# EAGLE design afe (EAGLE 6.6.0)

## Sheet 1 of 2
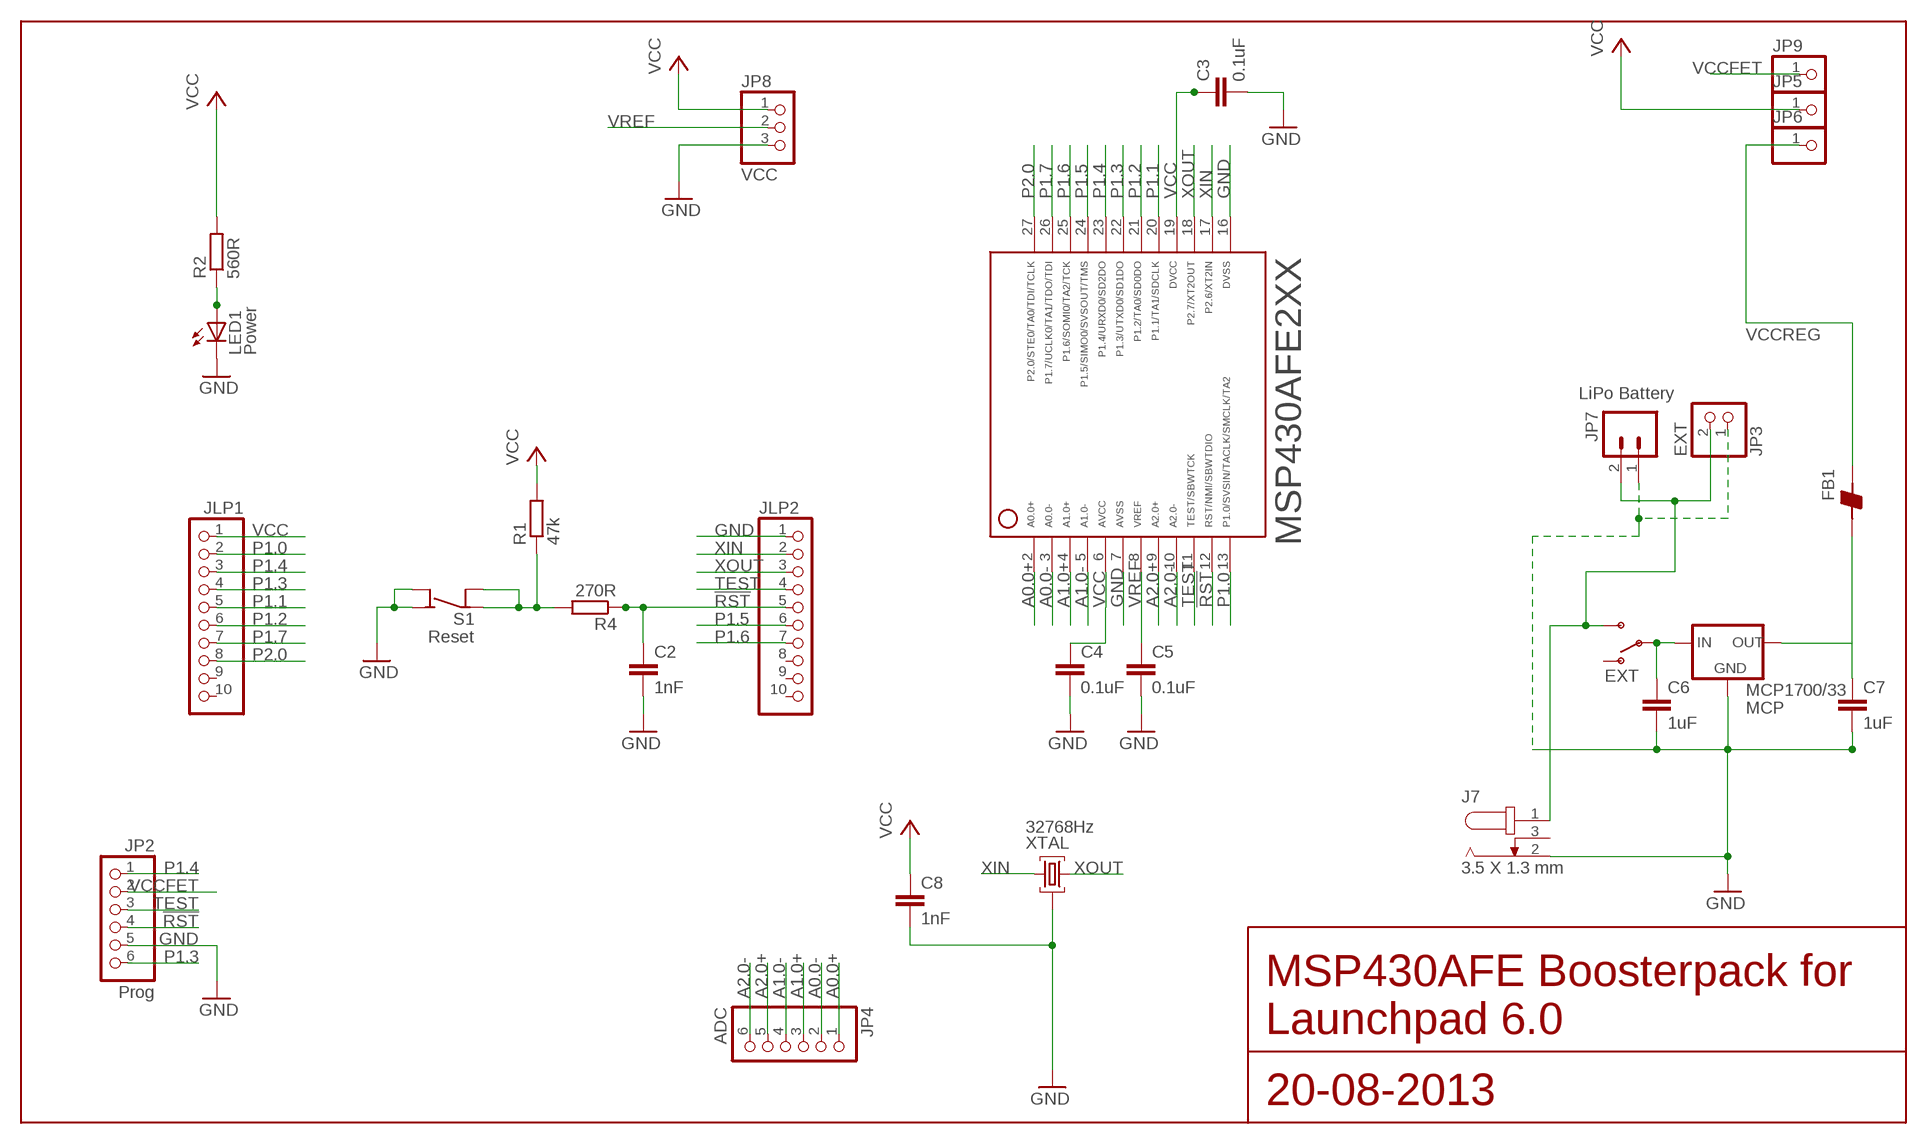
[diagram p0: schematic, sheet 1]

### Parts
C2  1nF  C-EUC0805  [C0805]
C3  0.1uF  C-EUC0805  [C0805]
C4  0.1uF  C-EUC0805  [C0805]
C5  0.1uF  C-EUC0805  [C0805]
C6  1uF  C-EUC0805  [C0805]
C7  1uF  C-EUC0805  [C0805]
C8  1nF  C-EUC0805  [C0805]
FB1  BEAD-0805  [0805]
J7  3.5 X 1.3 mm  DC_JACK_3.5X1.3MM  [3.5X1.3MM_DC_JACK]
JLP1  PH1X10OCT076  [PH1X10OCT76]
JLP2  PH1X10OCT076  [PH1X10OCT76]
JP2  Prog  PINHD-1X6  [1X06]
JP3  EXT  PINHD-1X2  [1X02]
JP4  ADC  PINHD-1X6  [1X06]
JP5  PINHD-1X1  [1X01]
JP6  PINHD-1X1  [1X01]
JP7  LiPo Battery  M02JST-PTH-2  [JST-2-PTH]
JP8  VCC  PINHD-1X3  [1X03]
JP9  PINHD-1X1  [1X01]
LED1  Power  LEDCHIPLED_1206  [CHIPLED_1206]
MCP1700/33  MCP  MCP1700SOT-23  [SOT-23]
MSP430AFE  AFE2XX--PW24  [PW24]
ON  EXT  SWITCH-SPSTPTH  [SWITCH-SPDT]
R1  47k  R-EU_R0805  [R0805]
R2  560R  R-EU_R0805  [R0805]
R4  270R  R-EU_R0805  [R0805]
S1  Reset  SPST4  [6MMTACTILE_4PIN]
XTAL  32768Hz  QUARZ5  [QUARZ5]

### Nets
!RST: C2.1 JLP2.5 JP2.4 MSP430AFE.12 R4.1
A0.0+ [AD]: JP4.1 MSP430AFE.2
A0.0- [AD]: JP4.2 MSP430AFE.3
A1.0+ [AD]: JP4.3 MSP430AFE.4
A1.0- [AD]: JP4.4 MSP430AFE.5
A2.0+ [AD]: JP4.5 MSP430AFE.9
A2.0- [AD]: JP4.6 MSP430AFE.10
GND [GND]: C2.2 C3.2 C4.2 C5.2 C6.2 C7.2 C8.2 J7.2 JLP2.1 JP2.5 JP3.1 JP7.1 JP8.3 LED1.C MCP1700/33.1(GND) MSP430AFE.7 MSP430AFE.16 S1.A1(NO) S1.A2(NO) XTAL.GND@0
N$4: LED1.A R2.1
N$5: R1.1 R4.2 S1.B1(COM) S1.B2(COM)
P1.0: JLP1.2 MSP430AFE.13
P1.1: JLP1.5 MSP430AFE.20
P1.2: JLP1.6 MSP430AFE.21
P1.3: JLP1.4 JP2.6 MSP430AFE.22
P1.4: JLP1.3 JP2.1 MSP430AFE.23
P1.5: JLP2.6 MSP430AFE.24
P1.6: JLP2.7 MSP430AFE.25
P1.7: JLP1.7 MSP430AFE.26
P2.0: JLP1.8 MSP430AFE.27
TEST: JLP2.4 JP2.3 MSP430AFE.11
VCC [VCC]: C3.1 C4.1 C8.1 JLP1.1 JP5.1 JP8.1 MSP430AFE.6 MSP430AFE.19 R1.2 R2.2
VCCEXT [VCCEXT]: J7.1 JP3.2 JP7.2 ON.3(S)
VCCFET [VCC]: JP2.2 JP9.1
VCCIN [VCCEXT]: C6.1 MCP1700/33.3(IN) ON.2(P)
VCCREG [VCCEXT]: FB1.2 JP6.1
VCCREGOUT [VCCEXT]: C7.1 FB1.1 MCP1700/33.2(OUT)
VREF: C5.1 JP8.2 MSP430AFE.8
XIN: JLP2.2 MSP430AFE.17 XTAL.2
XOUT: JLP2.3 MSP430AFE.18 XTAL.1
Unconnected: J7.3 JLP1.9 JLP1.10 JLP2.8 JLP2.9 JLP2.10 ON.1(O)

### Notes on the sheet
- MSP430AFE Boosterpack for
  Launchpad 6.0
- 20-08-2013

## Sheet 2 of 2

## Library data of the parts
C2-C8 = resistor:C-EU: CAPACITOR, European symbol
FB1 = CH_passive:BEAD
J7 = MY_CONN:DC_JACK_3.5X1.3MM
JLP1 JLP2 = MY_CONN:PH1X10
JP2 JP4 = pinhead:PINHD-1X6: PIN HEADER
JP3 = pinhead:PINHD-1X2: PIN HEADER
JP5 JP6 JP9 = pinhead:PINHD-1X1: PIN HEADER
JP7 = SparkFun:M02: Header 2 Standard 2-pin 0.1" header. Use with straight break away headers (SKU : PRT-00116), right angle break away headers (PRT-00553), swiss pins (PRT-00743), machine pins (PRT-00117), and female headers (PRT-00115). Molex polarized connector foot print use with SKU : PRT-08233 with associated crimp pins and housings.
JP8 = pinhead:PINHD-1X3: PIN HEADER
LED1 = adafruit:LED: LED OSRAM: - CHIPLED LG R971, LG N971, LY N971, LG Q971, LY Q971, LO R971, LY R971 LH N974, LH R974 LS Q976, LO Q976, LY Q976 LO Q996 - Hyper CHIPLED LW Q18S LB Q993, LB Q99A, LB R99A - SideLED LS A670, LO A670, LY A670, LG A670, LP A670 LB A673, LV A673, LT A673, LW A673 LH A674 LY A675 LS A676, LA A676, LO A676, LY A676, LW A676 LS A679, LY A679, LG A679 - Hyper Micro SIDELED® LS Y876, LA Y876, LO Y876, LY Y876 LT Y87S - SmartLED LW L88C, LW L88S LB L89C, LB L89S, LG L890 LS L89K, LO L89K, LY L89K LS L896, LA L896, LO L896, LY L896 - TOPLED LS T670, LO T670, LY T670, LG T670, LP T670 LSG T670, LSP T670, LSY T670, LOP T670, LYG T670 LG T671, LOG T671, LSG T671 LB T673, LV T673, LT T673, LW T673 LH T674 LS T676, LA T676, LO T676, LY T676, LB T676, LH T676, LSB T676, LW T676 LB T67C, LV T67C, LT T67C, LS T67K, LO T67K, LY T67K, LW E67C LS E67B, LA E67B, LO E67B, LY E67B, LB E67C, LV E67C, LT E67C LW T67C LS T679, LY T679, LG T679 LS T770, LO T770, LY T770, LG T770, LP T770 LB T773, LV T773, LT T773, LW T773 LH T774 LS E675, LA E675, LY E675, LS T675 LS T776, LA T776, LO T776, LY T776, LB T776 LHGB T686 LT T68C, LB T68C - Hyper Mini TOPLED® LB M676 - Mini TOPLED Santana® LG M470 LS M47K, LO M47K, LY M47K Source: http://www.osram.convergy.de/
MCP1700/33 = MY_IC:MCP1700
MSP430AFE = TI_MSP430_v16:AFE2XX--PW24
ON = SparkFun:SWITCH-SPST: SPST Switch Simple slide switch. Spark Fun Electronics SKU : COM-00102
R1 R2 R4 = resistor:R-EU_: RESISTOR, European symbol
S1 = mes_electromech:SPST4: SPST switch with 2 pins per contact
XTAL = my_xtal:QUARZ5

## Net classes
0 default: width 0.279 mm, drill 0.508 mm, clearance 0.229 mm
1 GND: width 0.61 mm, drill 0.508 mm, clearance 0.229 mm
2 VCC: width 0.61 mm, drill 0.508 mm, clearance 0.229 mm
3 AD: width 0.33 mm, drill 0.508 mm, clearance 0.229 mm
4 VCCEXT: width 0.762 mm, drill 0.508 mm, clearance 0.229 mm

## Board
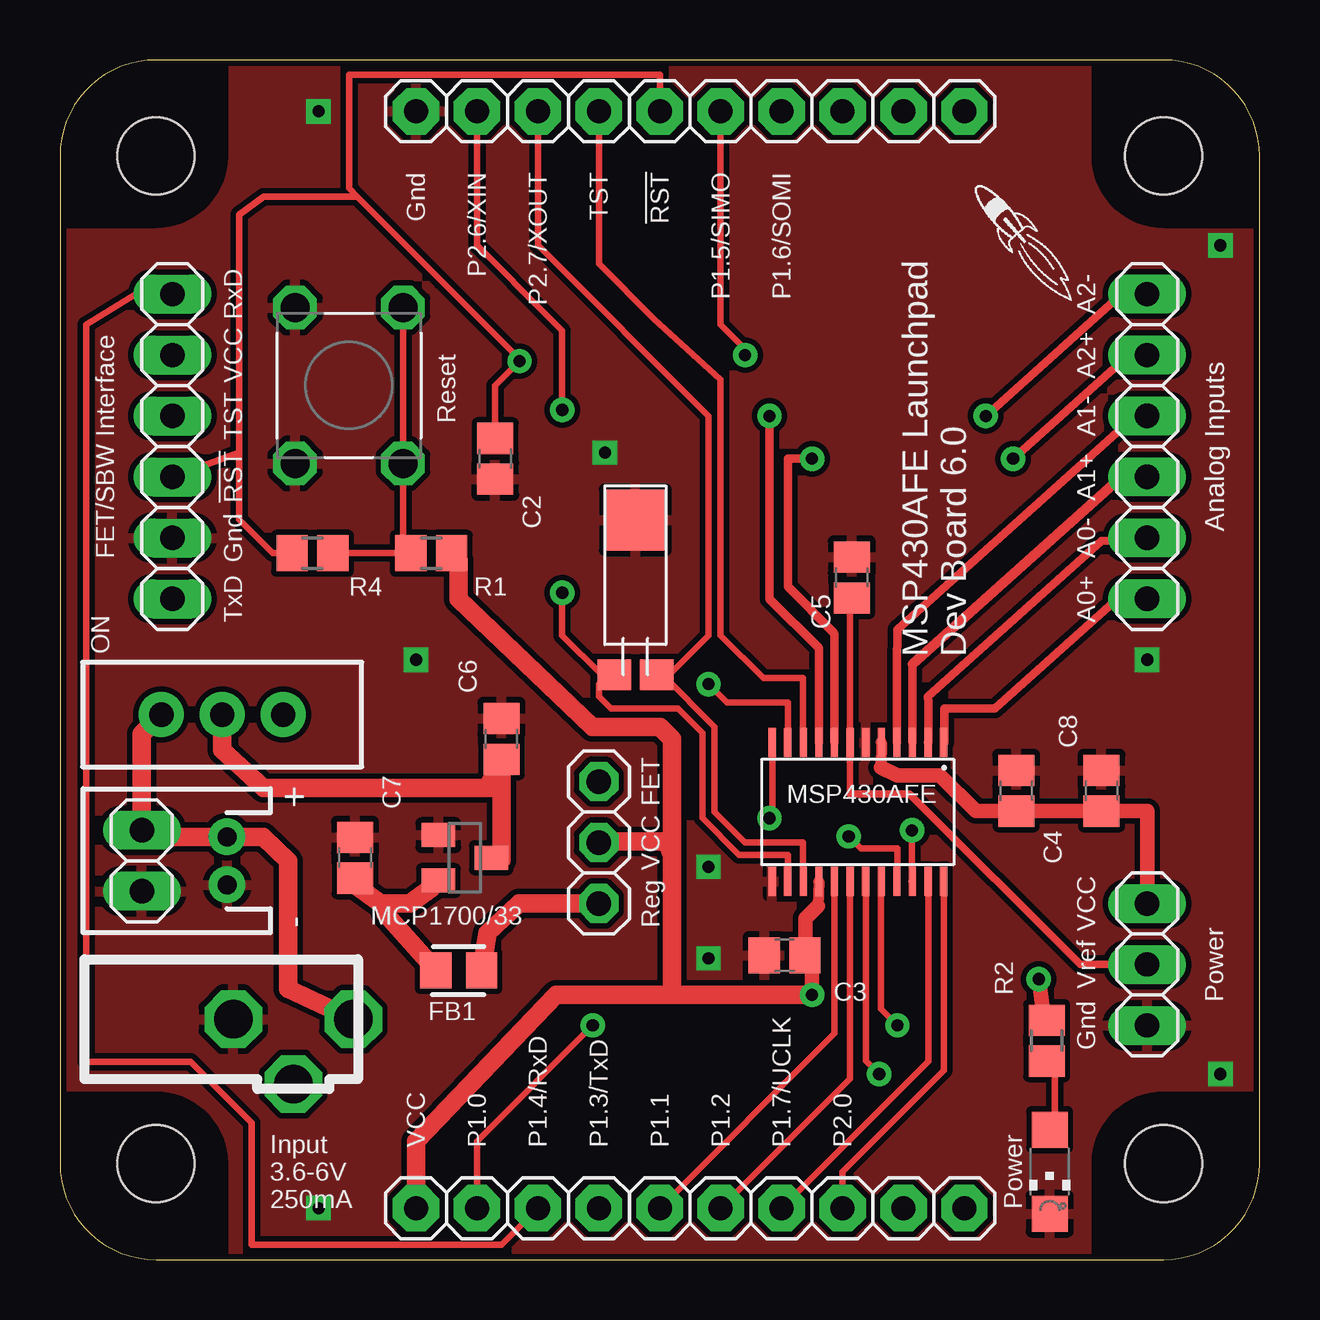
[diagram p1: board, top side]
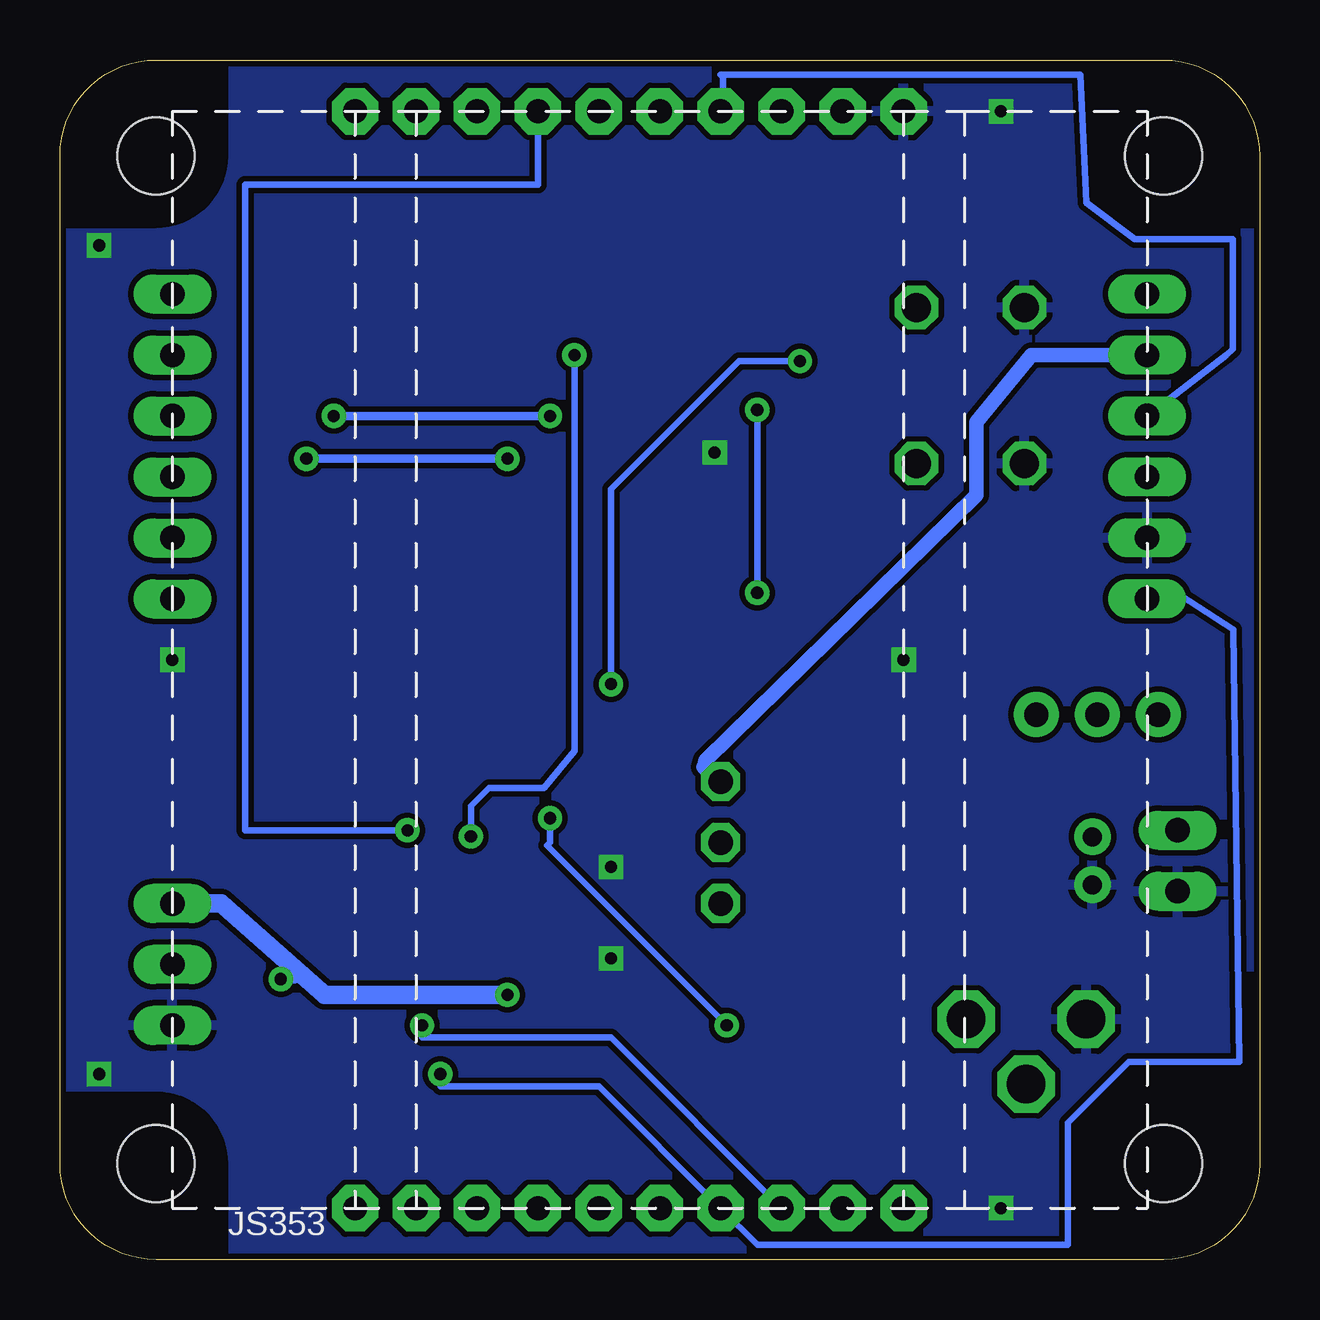
[diagram p2: board, bottom side, seen from below]

Size 50 x 50 mm. Coordinates in mm from the lower left corner, seen from the top.
Copper layers (1*16): Top 0.035mm / dielectric 1.5mm / Bottom 0.035mm
Design rules "SparkFun *": minimum track width 10mil, minimum drill 20mil, track to track 8mil, track to pad 8mil, pad to pad 8mil, via to via 8mil, smd to smd 8mil, copper to edge 10mil, drill to drill 8mil, minimum pad ring 12mil, minimum via ring 10mil, stop-mask expansion 4mil, vias tented up to drill 25mil, thermal gap 10mil

### Footprints (pad centres in the part's own frame; a part is rotated, then mirrored left to right if it is on the bottom)
C0805 = smd 1.3 x 1.5: 1 -0.85,0; 2 0.85,0
0805 = smd 1.3 x 1.5: 1 -0.95,0; 2 0.95,0
3.5X1.3MM_DC_JACK = drill 1.6 octagon: 1 0,0; 2 -5,0; 3 -2.5,-2.7
PH1X10OCT76 = drill 1 pad 1.93 octagon: 1 0,0; 2 2.54,0; 3 5.08,0; 4 7.62,0; 5 10.16,0; 6 12.7,0; 7 15.24,0; 8 17.78,0; 9 20.32,0; 10 22.86,0
1X06 = drill 1.016 long: 1 -6.35,0; 2 -3.81,0; 3 -1.27,0; 4 1.27,0; 5 3.81,0; 6 6.35,0
1X02 = drill 1.016 long: 1 -1.27,0; 2 1.27,0
1X01 = drill 1.016 octagon: 1 0,0
JST-2-PTH = drill 0.787 pad 1.524: 1 -1,0; 2 1,0
1X03 = drill 1.016 long: 1 -2.54,0; 2 0,0; 3 2.54,0
CHIPLED_1206 = smd 1.5 x 1.5: A 0,-1.75; C 0,1.75
SOT-23 = smd 1 x 1.4: 1 -0.95,-1.1; 2 0.95,-1.1; 3 0,1.1
PW24 = smd 0.3 x 1.2: 2 -3.579,-2.908; 3 -2.929,-2.908; 4 -2.279,-2.908; 5 -1.629,-2.908; 6 -0.979,-2.908; 7 -0.329,-2.908; 8 0.321,-2.908; 9 0.971,-2.908; 10 1.621,-2.908; 11 2.271,-2.908; 12 2.921,-2.908; 13 3.571,-2.908; 16 3.571,2.892; 17 2.921,2.892; 18 2.271,2.892; 19 1.621,2.892; 20 0.971,2.892; 21 0.321,2.892; 22 -0.329,2.892; 23 -0.979,2.892; 24 -1.629,2.892; 25 -2.279,2.892; 26 -2.929,2.892; 27 -3.579,2.892
SWITCH-SPDT = drill 1.016 pad 1.88: 1 0,2.54; 2 0,0; 3 0,-2.54
R0805 = smd 1.3 x 1.5: 1 -0.85,0; 2 0.85,0
6MMTACTILE_4PIN = drill 1.2 octagon: A1 3.25,-2.25; A2 -3.25,-2.25; B1 3.25,2.25; B2 -3.25,2.25
DP5050_V1 = hole 3.2: -21,-21; 21,-21; 21,21; -21,21
QUARZ5 = smd 1.27 x 1.397: 1 0,0.889; 2 0,-0.889 | smd 2.54 x 2.54: GND@0 -6.465,0

### Placement (x,y rotation side)
C2  18.14,33.38 270 top
C3  30.21,12.68 180 top
C4  39.86,19.54 90 top
C5  33,28.43 90 top
C6  18.4,21.7 90 top
C7  12.3,16.75 90 top
C8  43.41,19.54 90 top
FB1  16.62,12.05 0 top
J7  12.22,10.01 0 top
JLP1  14.84,2.14 0 top
JLP2  14.84,47.86 0 top
JP2  4.68,33.89 270 top
JP3  3.41,16.62 90 top
JP4  45.32,33.89 90 top
JP5  22.46,17.38 0 top
JP6  22.46,14.84 0 top
JP7  6.97,16.62 90 top
JP8  45.32,12.3 270 top
JP9  22.46,19.92 0 top
LED1  41.26,3.66 180 top
MCP1700/33  16.87,16.75 270 top
MSP430AFE  33.26,18.65 180 top
ON  6.76,22.71 270 top
R1  15.48,29.45 0 top
R2  41.13,9.13 90 top
R4  10.52,29.45 0 top
S1  12.05,36.43 270 top
U$1  [DP5050_V1]  25,25 0 top
U$2  [LOGO-ROCKET]  39.99,42.53 90 top
XTAL  23.98,24.37 270 top

### Tracks (layer width: path | path; a pad name or v marks a point on that pad's centre or on a via)
!RST  (via drill 0.51)
  Top 0.279: MSP430AFE.12 | MSP430AFE.12 30.33,23.22 27.79,23.22 v27.03,23.98 | JLP2.5 25,49.38 12.05,49.38 12.05,44.65 12.39,44.3 | 12.39,44.3 19.1,37.59 | 19.1,37.59 19.2,37.49 | 7.47,33.64 7.47,30.84 8.87,29.45 R4.1 | 7.47,33.64 JP2.4 | 7.47,33.64 7.47,43.54 8.49,44.3 12.39,44.3 | 19.1,37.59 19.11,37.6 v19.16,37.45 18.14,36.43 C2.1
  Bottom 0.279: v27.03,23.98 27.03,32.11 21.7,37.45 v19.16,37.45
A0.0+
  Top 0.356: MSP430AFE.2 36.86,21.56 36.86,22.97 38.97,22.97 43.92,27.41 JP4.1
A0.0-
  Top 0.356: MSP430AFE.3 36.2,21.56 36.2,23.22 36.18,23.48 43.41,29.95 JP4.2
A1.0+
  Top 0.356: JP4.3 43.92,32.34 | 35.53,24.82 MSP430AFE.4
  Top 0.406: 43.92,32.34 35.53,24.82
A1.0-
  Top 0.356: JP4.4 44.69,35.03 34.91,26.27 34.88,24.75 MSP430AFE.5
A2.0+  (via drill 0.51)
  Top 0.356: MSP430AFE.9 32.29,26.02 32.26,26.12 30.33,28.05 30.33,33.38 v31.35,33.38 | v39.73,33.38 44.56,37.7 JP4.5
  Bottom 0.356: v31.35,33.38 v39.73,33.38
A2.0-  (via drill 0.51)
  Top 0.356: MSP430AFE.10 31.63,25.48 29.57,27.54 v29.57,35.16 | v38.59,35.16 44.81,40.75 44.69,40.24 JP4.6
  Bottom 0.356: v29.57,35.16 v38.59,35.16
GND  (via drill 0.51)
  other vias: 27.03,16.36 27.03,12.55 10.78,2.14 22.71,33.64 48.37,42.27 45.32,25 48.37,7.73 10.78,47.86 14.84,25
  pour Top: -3.32,51.67 53.83,51.67 53.83,-2.18 -3.32,-2.18
  pour Bottom: -3.32,51.67 53.83,51.67 53.83,-2.18 -3.32,-2.18
N$4
  Top 0.279: LED1.A 41.41,5.19 41.46,5.9 41.46,7.73 41.26,7.93 R2.1
N$5
  Top 0.279: S1.B2 S1.B1 14.3,29.77 R1.1 R4.2
P1.0  (via drill 0.51)
  Top 0.279: MSP430AFE.13 29.7,21.56 29.7,18.5 29.67,18.5 v29.57,18.4 | JLP1.2 17.38,4.93 v22.21,9.76
  Bottom 0.279: v22.21,9.76 29.7,17.25 29.57,17.38 v29.57,18.4
P1.1
  Top 0.279: MSP430AFE.20 32.29,9.43 JLP1.5
P1.2
  Top 0.279: MSP430AFE.21 32.93,7.53 JLP1.6
P1.3  (via drill 0.51)
  Top 0.279: 33.58,16.01 MSP430AFE.22 33.59,8.29 v34.14,7.73
  Bottom 0.279: v34.14,7.73 34.14,7.22 27.54,7.22 JLP1.4 20.94,0.62 7.98,0.62 7.98,5.7 5.44,8.24 0.85,8.24 1.1,26.27 3.28,27.67 JP2.6
P1.4  (via drill 0.51)
  Top 0.279: MSP430AFE.23 34.22,10.45 v34.91,9.76 | JP2.1 3.16,40.24 1.1,38.97 1.1,8.24 5.44,8.24 7.98,5.7 7.98,0.62 18.4,0.62 JLP1.3
  Bottom 0.279: JLP1.3 27.03,9.25 34.91,9.25 v34.91,9.76
P1.5  (via drill 0.51)
  Top 0.279: 34.91,15.76 MSP430AFE.24 34.91,15.76 | 34.91,15.76 34.91,17.13 33.38,17.13 v32.87,17.63 | JLP2.6 27.54,38.97 28.56,37.95 v28.56,37.7
  Bottom 0.279: v32.87,17.63 32.87,18.9 32.11,19.67 29.83,19.67 28.56,21.19 v28.56,37.7
P1.6  (via drill 0.51)
  Top 0.279: MSP430AFE.25 35.54,15.76 | 35.52,15.76 v35.52,17.89
  Top 0.305: MSP430AFE.25 35.52,15.76
  Bottom 0.279: v35.52,17.89 42.27,17.89 42.27,44.81 30.08,44.81 JLP2.7
P1.7
  Top 0.279: MSP430AFE.26 36.2,15.76 36.2,13.82 36.2,8.26 JLP1.7
P2.0
  Top 0.279: MSP430AFE.27 36.84,7.88 32.62,3.66 JLP1.8
TEST
  Top 0.279: MSP430AFE.11 30.97,24.24 29.32,24.24 27.54,26.02 27.54,36.68 24.75,39.22 22.46,41.51 JLP2.4
  Bottom 0.279: 22.46,49.38 22.36,49.38 | 22.36,49.38 7.47,49.38 7.22,44.05 5.19,42.53 1.12,42.53 1.12,37.95 1.38,37.7 JP2.3 | 22.36,49.38 22.36,47.96 JLP2.4
VCC  (via drill 0.51)
  Top 0.457: MSP430AFE.19 31.6,14.74 | MSP430AFE.6 34.23,20.5
  Top 0.61: R1.2 16.62,29.15 | 25.51,11.11 25.55,11.07 v31.35,11.03 31.35,12.3 31.22,12.43 C3.1 | 34.23,20.5 34.91,20.17 36.68,20.17 38.17,18.69 C4.1 C8.1 45.32,18.69 JP8.1 | C3.1 31.1,12.47 | 31.6,14.74 31.07,14.21 31.07,13.06 31.1,12.81 31.1,12.61 C3.1 | 23.17,17.43 JP5.1 | 25.2,17.43 25.51,16.62 | v40.8,11.69 41.05,9.76 R2.2
  Top 0.762: v31.35,11.03 20.68,11.03 14.84,4.93 JLP1.1 | 16.62,29.15 16.62,27.54 22.21,22.21 25,22.21 25.51,21.7 25.51,16.62 25.51,11.11 | 25.2,17.43 23.17,17.43
  Bottom 0.61: v40.8,11.69 40.44,12.05 40.24,11.79 40.05,12
  Bottom 0.762: JP8.1 43.29,14.84 40.05,12 38.97,11.03 v31.35,11.03
VCCEXT
  Top 0.762: ON.3 3.41,21.9 JP3.2 3.68,17.62 JP7.2 8.47,17.62 9.51,16.62 9.51,11.28 J7.1
VCCFET
  Bottom 0.61: JP2.2 9.51,37.7 11.79,34.91 11.79,31.86 23.1,20.81 23.17,20.53 22.56,19.92 JP9.1
VCCIN
  Top 0.762: ON.2 6.76,21.24 8.49,19.67 18.4,19.67 | 18.4,19.67 C6.1 17.94,19.92 18.4,19.67 | 18.4,19.67 18.4,16.66 MCP1700/33.3
VCCREG
  Top 0.762: JP6.1 19.14,14.84 17.82,13.62 FB1.2
VCCREGOUT
  Top 0.762: C7.1 12.4,15.54 13.36,14.84 13.57,14.84 | 13.57,14.84 14.59,14.84 15.52,15.52 MCP1700/33.2 | FB1.1 13.57,14.4 13.57,14.84
VREF
  Top 0.279: MSP430AFE.8 | 32.79,27.97 32.93,27.83 | 32.93,19.41 32.93,21.5 MSP430AFE.8 | MSP430AFE.8 32.93,27.83 32.79,27.97 | C5.1 33,27.97 32.79,27.97
  Top 0.305: 32.93,27.83 32.93,27.79 | JP8.2 42.53,12.3 35.41,19.41 32.93,19.41
XIN  (via drill 0.51)
  Top 0.279: MSP430AFE.17 | MSP430AFE.17 30.33,16.87 28.3,16.87 26.78,18.4 26.78,21.95 25.76,22.97 22.97,22.97 22.46,23.48 22.46,23.98 22.84,24.37 | 22.84,24.37 XTAL.2 | JLP2.2 17.38,42.27 20.43,39.22 20.94,38.72 v20.94,35.41 | 22.84,24.37 22.59,24.37 20.94,26.02 v20.94,27.79
  Bottom 0.279: v20.94,27.79 v20.94,35.41
XOUT
  Top 0.279: MSP430AFE.18 30.97,17.38 28.56,17.38 27.29,18.65 27.29,22.21 25.13,24.37 XTAL.1 25.38,24.37 27.03,26.02 27.03,35.16 19.92,42.27 JLP2.3

### Text on the board
tNames: Gnd | P2.6/XIN | P2.7/XOUT | TST | !RST | P1.5/SIMO | P1.6/SOMI | RxD | A2- | VCC | A2+ | TST | A1- | FET/SBW Interface | Analog Inputs | !RST | A1+ | Gnd | A0- | TxD | A0+ | MSP430AFE Launchpad / Dev Board 6.0 | + | FET | VCC | Reg | VCC | - | Vref | Power | Gnd | VCC | P1.0 | P1.4/RxD | P1.3/TxD | P1.1 | P1.2 | P1.7/UCLK | P2.0 | Input / 3.6-6V / 250mA